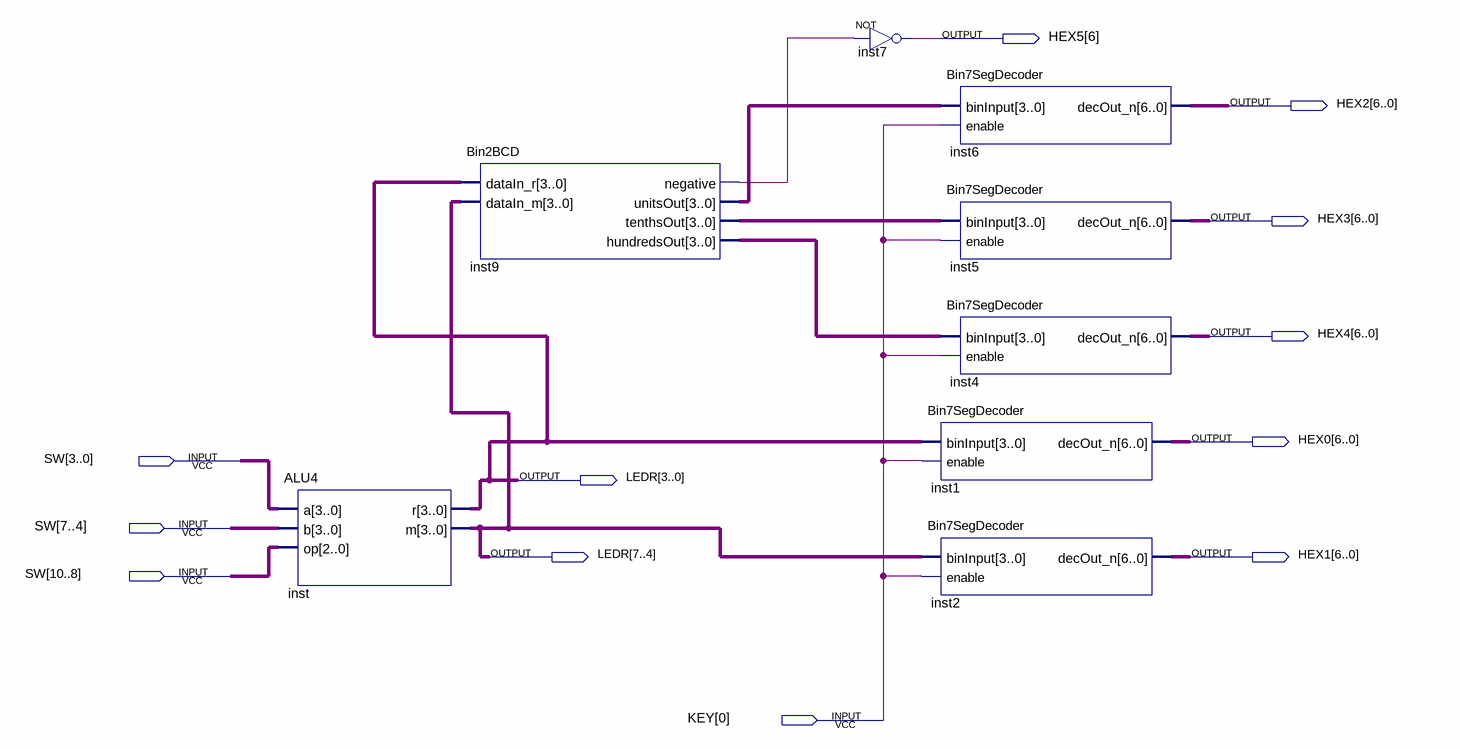
[diagram p0: schematic sheet]
// Quartus schematic ALUDemo.bdf as structural Verilog: 8 symbols, 12 pins
module ALUDemo (
  input  [10:0] SW,
  input  [0:0] KEY,
  output [6:6] HEX5,
  output [6:0] HEX2,
  output [6:0] HEX3,
  output [6:0] HEX4,
  output [6:0] HEX0,
  output [7:0] LEDR,
  output [6:0] HEX1
);

  wire inst9_negative;
  wire [3:0] inst9_hundredsout, inst9_tenthsout, inst9_unitsout;

  ALU4 inst (.a(SW[3:0]), .b(SW[7:4]), .op(SW[10:8]), .r(LEDR[3:0]), .m(LEDR[7:4]));
  Bin2BCD inst9 (
    .dataIn_r(LEDR[3:0]), .dataIn_m(LEDR[7:4]), .negative(inst9_negative), .unitsOut(inst9_unitsout),
    .tenthsOut(inst9_tenthsout), .hundredsOut(inst9_hundredsout));
  not inst7 (HEX5[6], inst9_negative);
  Bin7SegDecoder inst1 (.binInput(LEDR[3:0]), .enable(KEY[0]), .decOut_n(HEX0));
  Bin7SegDecoder inst2 (.binInput(LEDR[7:4]), .enable(KEY[0]), .decOut_n(HEX1));
  Bin7SegDecoder inst6 (.binInput(inst9_unitsout), .enable(KEY[0]), .decOut_n(HEX2));
  Bin7SegDecoder inst5 (.binInput(inst9_tenthsout), .enable(KEY[0]), .decOut_n(HEX3));
  Bin7SegDecoder inst4 (.binInput(inst9_hundredsout), .enable(KEY[0]), .decOut_n(HEX4));
endmodule
